# EAGLE design Zed Camera (EAGLE 6.2)
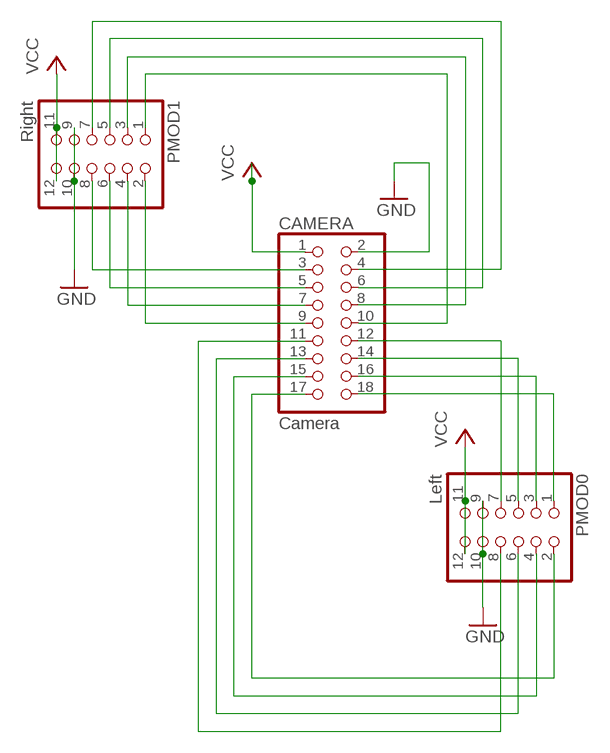
[diagram p0: schematic, sheet 1]

## Parts
CAMERA  Camera  PINHD-2X9  [2X09]
PMOD0  Left  PINHD-2X6  [2X06]
PMOD1  Right  PINHD-2X6  [2X06]

## Nets
CAMERA: CAMERA.15 PMOD0.4
GND: CAMERA.2 PMOD0.9 PMOD0.10 PMOD1.9 PMOD1.10
N$1: CAMERA.18 PMOD0.1
N$2: CAMERA.16 PMOD0.3
N$3: CAMERA.14 PMOD0.5
N$4: CAMERA.12 PMOD0.7
N$5: CAMERA.17 PMOD0.2
N$6: CAMERA.11 PMOD0.8
N$7: CAMERA.9 PMOD1.2
N$8: CAMERA.7 PMOD1.4
N$9: CAMERA.5 PMOD1.6
N$10: CAMERA.3 PMOD1.8
N$11: CAMERA.10 PMOD1.1
N$12: CAMERA.8 PMOD1.3
N$13: CAMERA.6 PMOD1.5
N$14: CAMERA.4 PMOD1.7
N$15: CAMERA.13 PMOD0.6
VCC: CAMERA.1 PMOD0.11 PMOD0.12 PMOD1.11 PMOD1.12

## Library data of the parts
CAMERA = pinhead:PINHD-2X9: PIN HEADER
PMOD0 PMOD1 = pinhead:PINHD-2X6: PIN HEADER

## Board
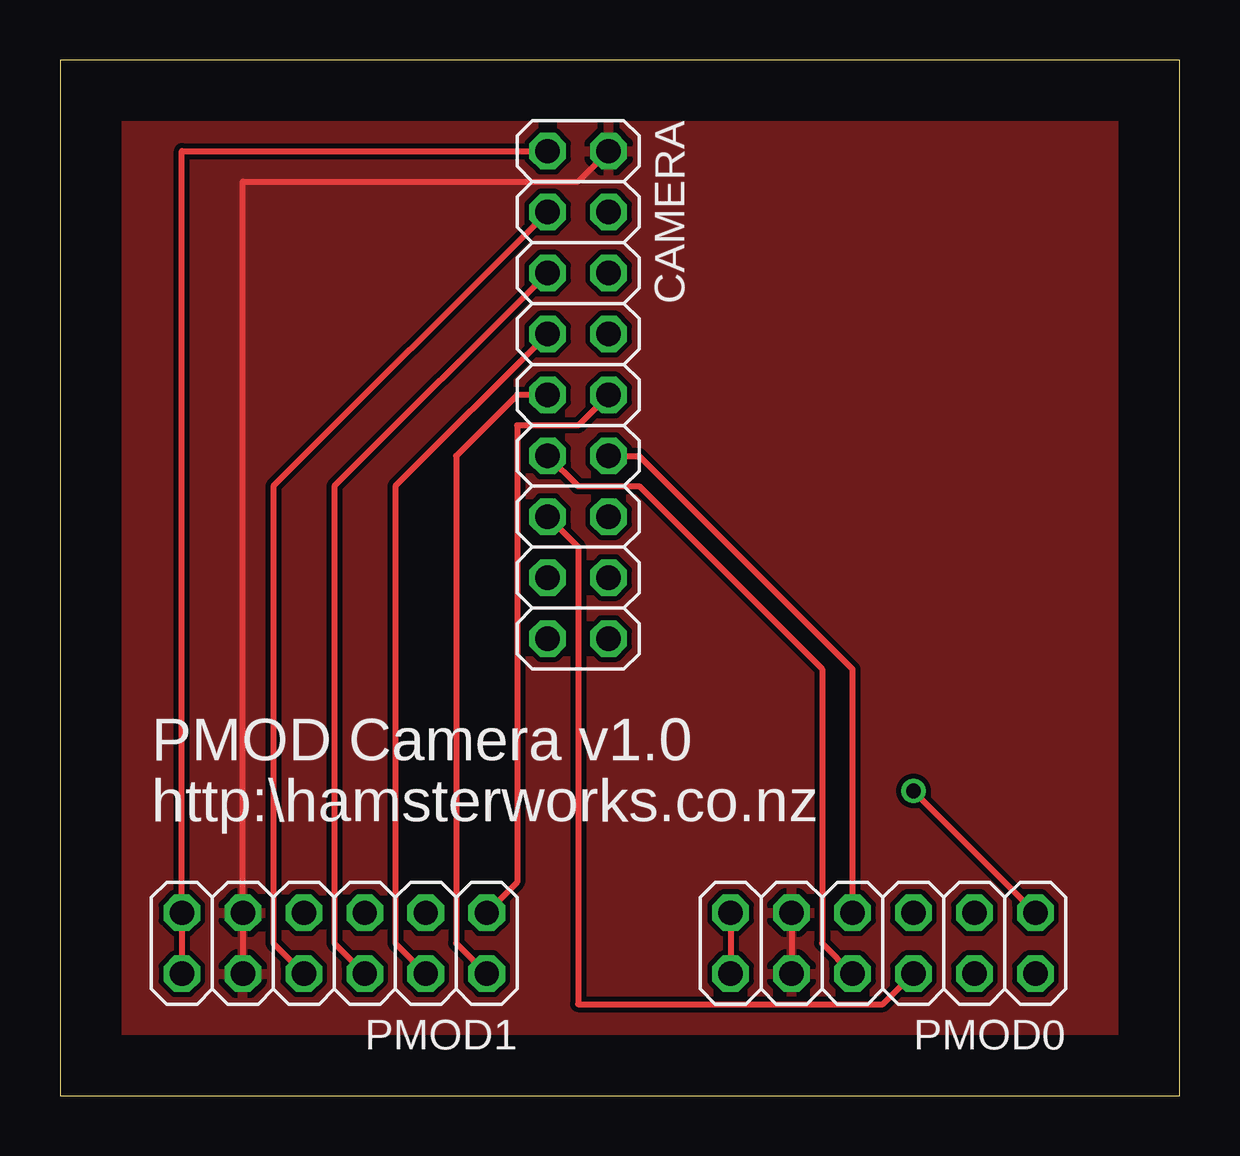
[diagram p1: board, top side]
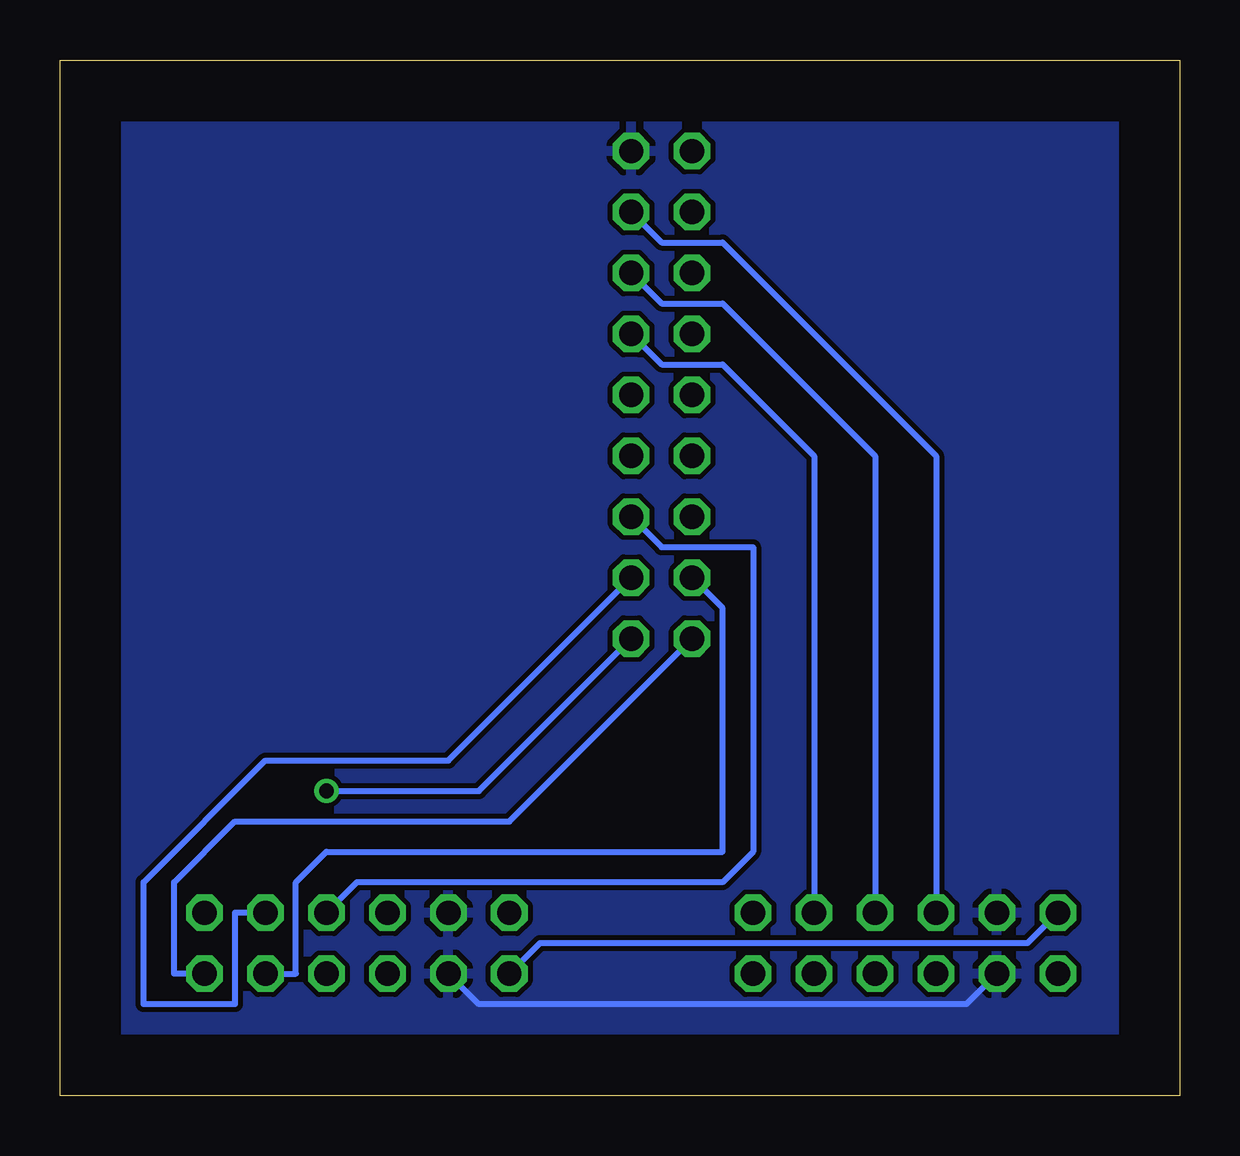
[diagram p2: board, bottom side, seen from below]

Size 46.66 x 43.17 mm. Coordinates in mm from the lower left corner, seen from the top.
Outline: 0,0 46.66,0 46.66,43.17 0,43.17 0,0
Copper layers (1*16): Top 0.035mm / dielectric 1.5mm / Bottom 0.035mm
Design rules: minimum track width 10mil, minimum drill 24mil, track to track 8mil, track to pad 8mil, pad to pad 8mil, via to via 8mil, smd to smd 8mil, copper to edge 100mil, drill to drill 8mil, minimum pad ring 10mil, minimum via ring 8mil, stop-mask expansion 4mil, vias tented up to drill 0mil, thermal gap 10mil

### Footprints (pad centres in the part's own frame; a part is rotated, then mirrored left to right if it is on the bottom)
2X09 = drill 1.016 octagon: 1 -10.16,-1.27; 2 -10.16,1.27; 3 -7.62,-1.27; 4 -7.62,1.27; 5 -5.08,-1.27; 6 -5.08,1.27; 7 -2.54,-1.27; 8 -2.54,1.27; 9 0,-1.27; 10 0,1.27; 11 2.54,-1.27; 12 2.54,1.27; 13 5.08,-1.27; 14 5.08,1.27; 15 7.62,-1.27; 16 7.62,1.27; 17 10.16,-1.27; 18 10.16,1.27
2X06 = drill 1.016 octagon: 1 -6.35,-1.27; 2 -6.35,1.27; 3 -3.81,-1.27; 4 -3.81,1.27; 5 -1.27,-1.27; 6 -1.27,1.27; 7 1.27,-1.27; 8 1.27,1.27; 9 3.81,-1.27; 10 3.81,1.27; 11 6.35,-1.27; 12 6.35,1.27

### Placement (x,y rotation side)
CAMERA  21.59,29.21 270 top
PMOD0  34.29,6.35 180 top
PMOD1  11.43,6.35 180 top

### Tracks (layer width: path | path; a pad name or v marks a point on that pad's centre or on a via)
CAMERA
  Bottom 0.254: CAMERA.15 19.05,20.32 19.05,10.16 35.56,10.16 36.83,8.89 36.83,5.08 PMOD0.4
GND
  Top 0.254: PMOD0.9 PMOD0.10 | PMOD1.10 PMOD1.9 7.62,38.1 21.59,38.1 CAMERA.2
  Bottom 0.254: PMOD0.10 29.21,3.81 8.89,3.81 PMOD1.10
  pour Bottom: 0,43.18 46.99,43.18 46.99,0 0,0
  pour Top: 0,43.18 46.99,43.18 46.99,0 0,0
N$1  (via drill 0.61)
  Top 0.254: PMOD0.1 v35.56,12.7
  Bottom 0.254: CAMERA.18 29.21,12.7 v35.56,12.7
N$2
  Bottom 0.254: CAMERA.16 30.48,13.97 38.1,13.97 43.18,8.89 43.18,3.81 39.37,3.81 39.37,7.62 PMOD0.3
N$3
  Bottom 0.254: PMOD0.5 34.29,8.89 19.05,8.89 17.78,10.16 17.78,22.86 21.59,22.86 CAMERA.14
N$4
  Top 0.254: PMOD0.7 33.02,17.78 24.13,26.67 CAMERA.12
N$5
  Bottom 0.254: CAMERA.17 27.94,11.43 39.37,11.43 41.91,8.89 41.91,5.08 PMOD0.2
N$6
  Top 0.254: PMOD0.8 31.75,6.35 31.75,17.78 24.13,25.4 21.59,25.4 CAMERA.11
N$7
  Top 0.254: PMOD1.2 16.51,6.35 16.51,26.67 19.05,29.21 CAMERA.9
N$8
  Top 0.254: PMOD1.4 13.97,6.35 13.97,25.4 CAMERA.7
N$9
  Top 0.254: PMOD1.6 11.43,6.35 11.43,25.4 CAMERA.5
N$10
  Top 0.254: PMOD1.8 8.89,6.35 8.89,25.4 CAMERA.3
N$11
  Top 0.254: PMOD1.1 19.05,8.89 19.05,27.94 21.59,27.94 CAMERA.10
N$12
  Bottom 0.254: PMOD1.3 15.24,26.67 19.05,30.48 21.59,30.48 CAMERA.8
N$13
  Bottom 0.254: PMOD1.5 12.7,26.67 19.05,33.02 21.59,33.02 CAMERA.6
N$14
  Bottom 0.254: PMOD1.7 10.16,26.67 19.05,35.56 21.59,35.56 CAMERA.4
N$15
  Top 0.254: PMOD0.6 34.29,3.81 21.59,3.81 21.59,22.86 CAMERA.13
VCC
  Top 0.254: PMOD0.11 PMOD0.12 | PMOD1.12 PMOD1.11 5.08,39.37 CAMERA.1
  Bottom 0.254: PMOD0.12 26.67,6.35 6.35,6.35 PMOD1.11

### Text on the board
tNames: PMOD Camera v1.0 | http:\\hamsterworks.co.nz